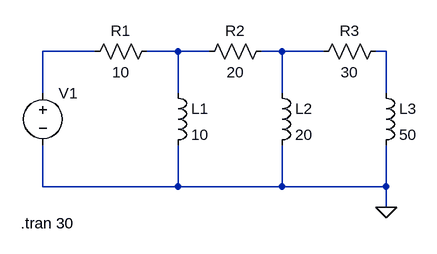
[diagram p0: schematic Draft7.asc]
Draft7.asc, the LTspice schematic file:
Version 4
SHEET 1 880 680
WIRE -16 96 -96 96
WIRE 112 96 64 96
WIRE 160 96 112 96
WIRE 272 96 240 96
WIRE 336 96 272 96
WIRE 432 96 416 96
WIRE -96 160 -96 96
WIRE 112 160 112 96
WIRE 272 160 272 96
WIRE 432 160 432 96
WIRE -96 304 -96 240
WIRE 112 304 112 240
WIRE 112 304 -96 304
WIRE 272 304 272 240
WIRE 272 304 112 304
WIRE 432 304 432 240
WIRE 432 304 272 304
WIRE 432 336 432 304
FLAG 432 336 0
SYMBOL ind 96 144 R0
SYMATTR InstName L1
SYMATTR Value 10
SYMATTR SpiceLine Rser=1f
SYMBOL ind 256 144 R0
SYMATTR InstName L2
SYMATTR Value 20
SYMATTR SpiceLine Rser=1f
SYMBOL ind 416 144 R0
SYMATTR InstName L3
SYMATTR Value 50
SYMATTR SpiceLine Rser=1f
SYMBOL res 80 80 R90
WINDOW 0 0 56 VBottom 2
WINDOW 3 32 56 VTop 2
SYMATTR InstName R1
SYMATTR Value 10
SYMBOL res 256 80 R90
WINDOW 0 0 56 VBottom 2
WINDOW 3 32 56 VTop 2
SYMATTR InstName R2
SYMATTR Value 20
SYMBOL res 432 80 R90
WINDOW 0 0 56 VBottom 2
WINDOW 3 32 56 VTop 2
SYMATTR InstName R3
SYMATTR Value 30
SYMBOL voltage -96 144 R0
WINDOW 3 24 96 Invisible 2
WINDOW 39 0 0 Left 0
SYMATTR InstName V1
SYMATTR Value SINE(0 25 0.223196)
SYMATTR Value2 AC 25
TEXT -130 360 Left 2 !.tran 30

The netlist it stands for:
* Draft7.asc
L1 N002 0 10 Rser=1f
L2 N003 0 20 Rser=1f
L3 N004 0 50 Rser=1f
R1 N002 N001 10
R2 N003 N002 20
R3 N004 N003 30
V1 N001 0 SINE(0 25 0.223196) AC 25
.tran 30
.backanno
.end